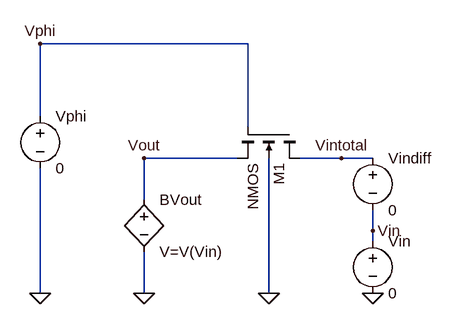
[diagram p0: schematic Chapter03A_05.fig.asc]
Chapter03A_05.fig.asc, the LTspice schematic file:
Version 4
SHEET 1 2940 740
WIRE 384 112 64 112
WIRE 64 224 64 112
WIRE 384 240 384 112
WIRE 368 288 224 288
WIRE 528 288 464 288
WIRE 576 288 528 288
WIRE 224 352 224 288
WIRE 576 400 576 368
WIRE 576 416 576 400
WIRE 64 496 64 304
WIRE 224 496 224 432
WIRE 416 496 416 288
FLAG 64 496 0
FLAG 224 496 0
FLAG 576 496 0
FLAG 416 496 0
FLAG 64 112 Vphi
FLAG 224 288 Vout
FLAG 576 400 Vin
FLAG 528 288 Vintotal
SYMBOL nmos4 464 240 R90
SYMATTR InstName M1
SYMBOL voltage 64 208 R0
WINDOW 123 0 0 Left 0
WINDOW 39 0 0 Left 0
SYMATTR InstName Vphi
SYMATTR Value 0
SYMBOL voltage 576 400 R0
SYMATTR InstName Vin
SYMATTR Value 0
SYMBOL bv 224 336 R0
SYMATTR InstName BVout
SYMATTR Value V=V(Vin)
SYMBOL voltage 576 272 R0
SYMATTR InstName Vindiff
SYMATTR Value 0

The netlist it stands for:
* Chapter03A_05.fig.asc
M1 Vintotal Vphi Vout 0 NMOS
Vphi Vphi 0 0
Vin Vin 0 0
BVout Vout 0 V=V(Vin)
Vindiff Vintotal Vin 0
.model NMOS NMOS
.model PMOS PMOS
.lib standard.mos
.backanno
.end